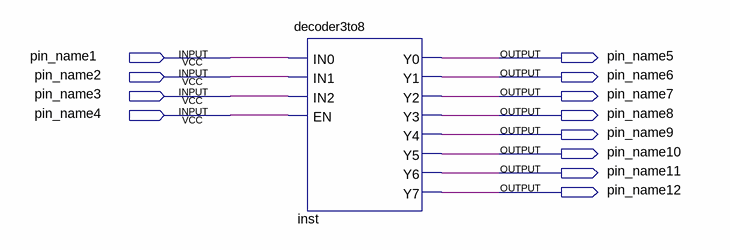
[diagram p0: schematic sheet]
// Quartus schematic TEST.bdf as structural Verilog: 1 symbols, 12 pins
module TEST (
  input  pin_name1,
  input  pin_name2,
  input  pin_name3,
  input  pin_name4,
  output pin_name5,
  output pin_name6,
  output pin_name7,
  output pin_name8,
  output pin_name9,
  output pin_name10,
  output pin_name11,
  output pin_name12
);

  decoder3to8 inst (
    .IN0(pin_name1), .IN1(pin_name2), .IN2(pin_name3), .EN(pin_name4), .Y0(pin_name5), .Y1(pin_name6),
    .Y2(pin_name7), .Y3(pin_name8), .Y4(pin_name9), .Y5(pin_name10), .Y6(pin_name11), .Y7(pin_name12));
endmodule
